# EAGLE design releborne (EAGLE 6.4)
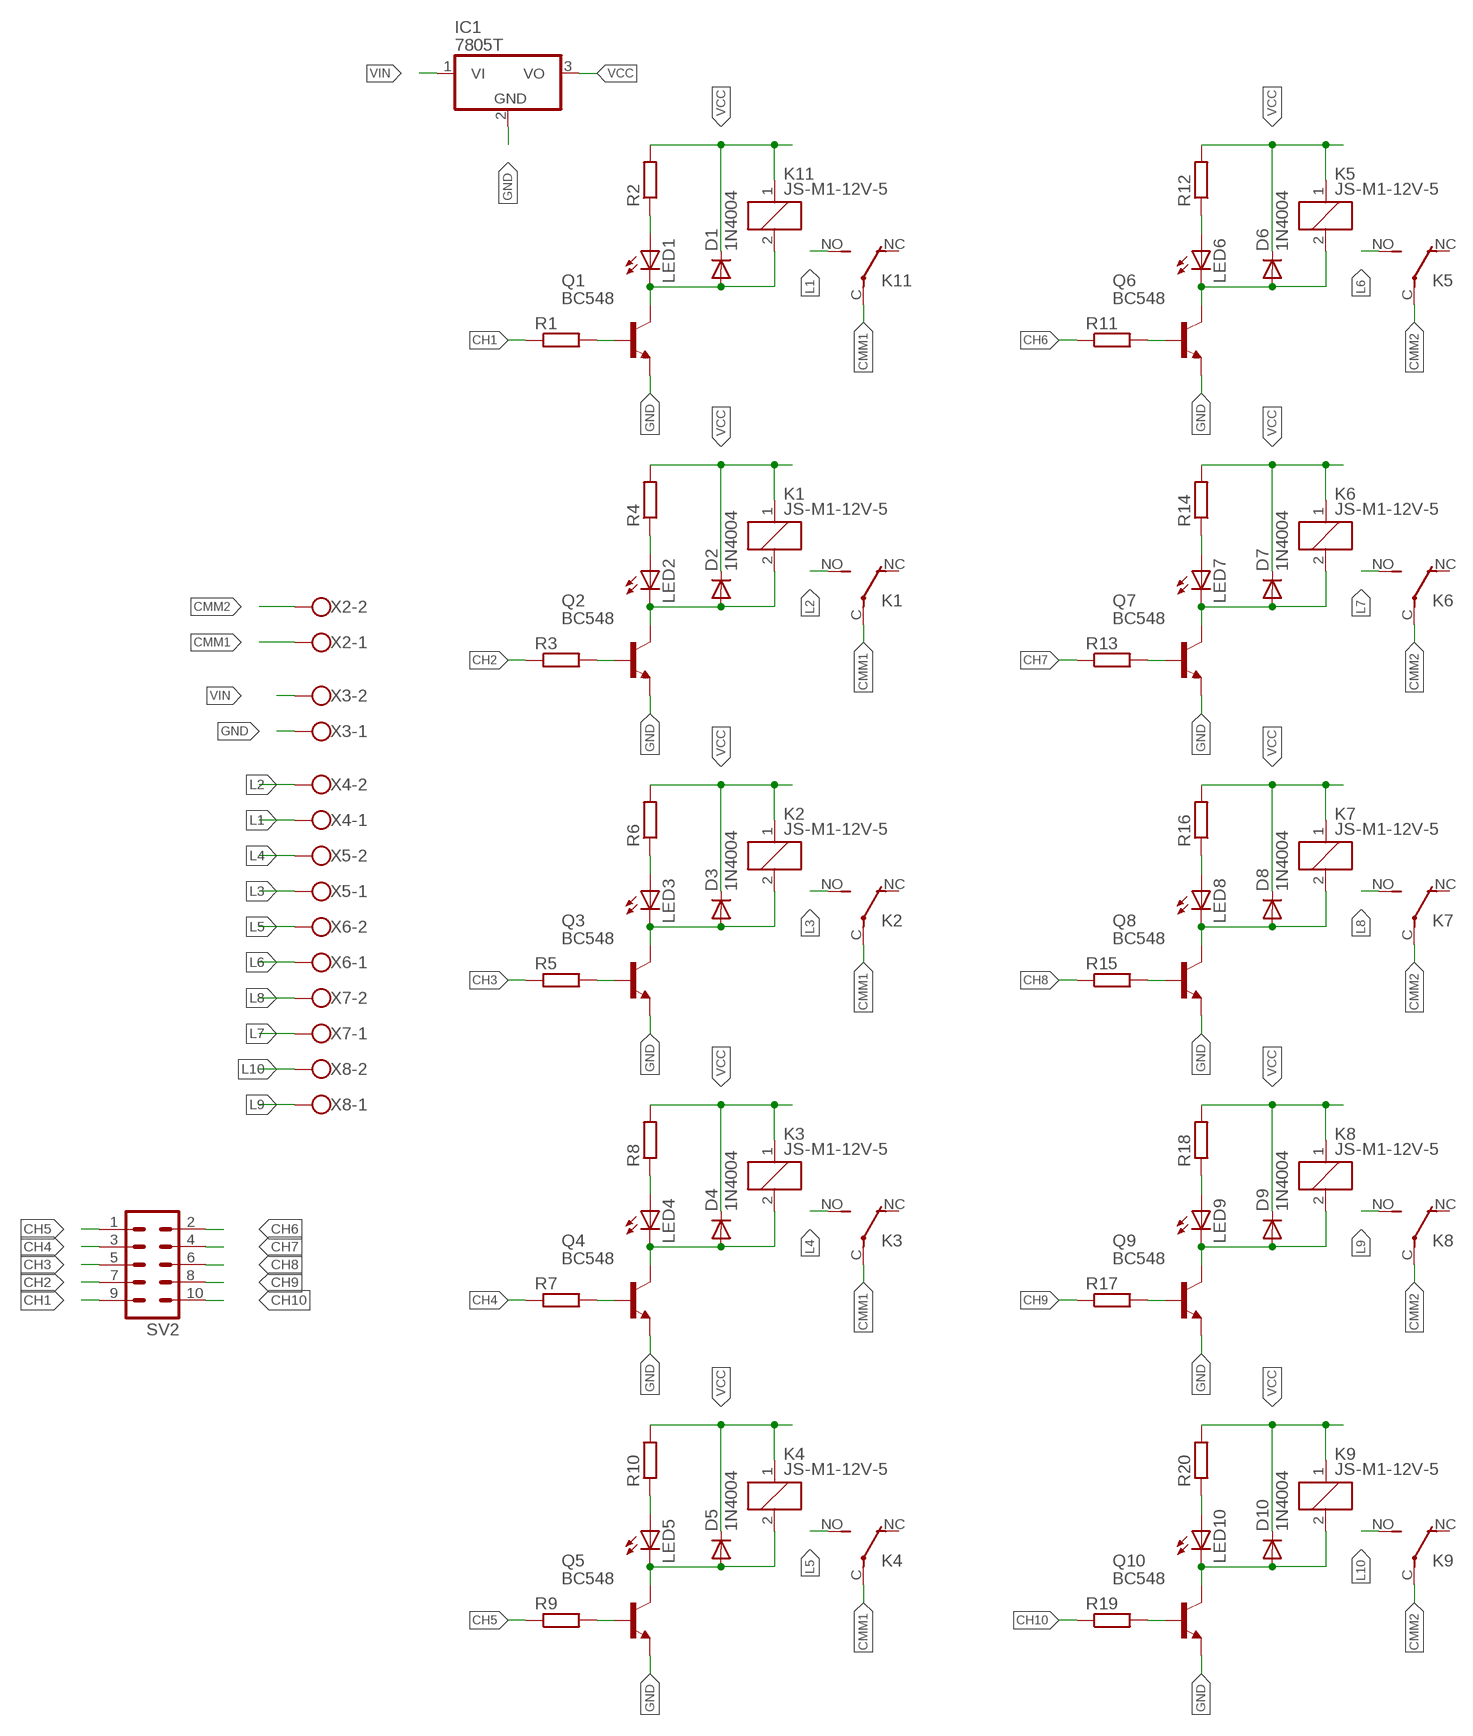
[diagram p0: schematic, sheet 1]

## Parts
D1  1N4004  [DO41-10]
D2  1N4004  [DO41-10]
D3  1N4004  [DO41-10]
D4  1N4004  [DO41-10]
D5  1N4004  [DO41-10]
D6  1N4004  [DO41-10]
D7  1N4004  [DO41-10]
D8  1N4004  [DO41-10]
D9  1N4004  [DO41-10]
D10  1N4004  [DO41-10]
IC1  7805T  [TO220H]
K1  JS-M1-12V-5  [JS-M]
K2  JS-M1-12V-5  [JS-M]
K3  JS-M1-12V-5  [JS-M]
K4  JS-M1-12V-5  [JS-M]
K5  JS-M1-12V-5  [JS-M]
K6  JS-M1-12V-5  [JS-M]
K7  JS-M1-12V-5  [JS-M]
K8  JS-M1-12V-5  [JS-M]
K9  JS-M1-12V-5  [JS-M]
K11  JS-M1-12V-5  [JS-M]
LED1  LED5MM  [LED5MM]
LED2  LED5MM  [LED5MM]
LED3  LED5MM  [LED5MM]
LED4  LED5MM  [LED5MM]
LED5  LED5MM  [LED5MM]
LED6  LED5MM  [LED5MM]
LED7  LED5MM  [LED5MM]
LED8  LED5MM  [LED5MM]
LED9  LED5MM  [LED5MM]
LED10  LED5MM  [LED5MM]
Q1  BC548  [TO92-EBC]
Q2  BC548  [TO92-EBC]
Q3  BC548  [TO92-EBC]
Q4  BC548  [TO92-EBC]
Q5  BC548  [TO92-EBC]
Q6  BC548  [TO92-EBC]
Q7  BC548  [TO92-EBC]
Q8  BC548  [TO92-EBC]
Q9  BC548  [TO92-EBC]
Q10  BC548  [TO92-EBC]
R1  R-EU_0207/10  [0207/10]
R2  R-EU_0207/10  [0207/10]
R3  R-EU_0207/10  [0207/10]
R4  R-EU_0207/10  [0207/10]
R5  R-EU_0207/10  [0207/10]
R6  R-EU_0207/10  [0207/10]
R7  R-EU_0207/10  [0207/10]
R8  R-EU_0207/10  [0207/10]
R9  R-EU_0207/10  [0207/10]
R10  R-EU_0207/10  [0207/10]
R11  R-EU_0207/10  [0207/10]
R12  R-EU_0207/10  [0207/10]
R13  R-EU_0207/10  [0207/10]
R14  R-EU_0207/10  [0207/10]
R15  R-EU_0207/10  [0207/10]
R16  R-EU_0207/10  [0207/10]
R17  R-EU_0207/10  [0207/10]
R18  R-EU_0207/10  [0207/10]
R19  R-EU_0207/10  [0207/10]
R20  R-EU_0207/10  [0207/10]
SV2  MA05-2  [MA05-2]
X2  W237-102  [W237-102]
X3  W237-102  [W237-102]
X4  W237-102  [W237-102]
X5  W237-102  [W237-102]
X6  W237-102  [W237-102]
X7  W237-102  [W237-102]
X8  W237-102  [W237-102]

## Nets
CH1: R1.1 SV2.9
CH2: R3.1 SV2.7
CH3: R5.1 SV2.5
CH4: R7.1 SV2.3
CH5: R9.1 SV2.1
CH6: R11.1 SV2.2
CH7: R13.1 SV2.4
CH8: R15.1 SV2.6
CH9: R17.1 SV2.8
CH10: R19.1 SV2.10
CMM1: K1.C(2:P) K2.C(2:P) K3.C(2:P) K4.C(2:P) K11.C(2:P) X2.1
CMM2: K5.C(2:P) K6.C(2:P) K7.C(2:P) K8.C(2:P) K9.C(2:P) X2.2
GND: IC1.2(GND) Q1.E Q2.E Q3.E Q4.E Q5.E Q6.E Q7.E Q8.E Q9.E Q10.E X3.1
L1: K11.NO(2:S) X4.1
L2: K1.NO(2:S) X4.2
L3: K2.NO(2:S) X5.1
L4: K3.NO(2:S) X5.2
L5: K4.NO(2:S) X6.2
L6: K5.NO(2:S) X6.1
L7: K6.NO(2:S) X7.1
L8: K7.NO(2:S) X7.2
L9: K8.NO(2:S) X8.1
L10: K9.NO(2:S) X8.2
N$1: Q1.B R1.2
N$2: LED1.A R2.1
N$3: Q2.B R3.2
N$4: LED2.A R4.1
N$5: D1.A K11.2 LED1.K(C) Q1.C
N$6: D2.A K1.2 LED2.K(C) Q2.C
N$7: Q3.B R5.2
N$8: LED3.A R6.1
N$9: D3.A K2.2 LED3.K(C) Q3.C
N$10: Q4.B R7.2
N$11: LED4.A R8.1
N$12: D4.A K3.2 LED4.K(C) Q4.C
N$13: Q5.B R9.2
N$14: LED5.A R10.1
N$15: D5.A K4.2 LED5.K(C) Q5.C
N$16: Q6.B R11.2
N$17: LED6.A R12.1
N$18: D6.A K5.2 LED6.K(C) Q6.C
N$19: Q7.B R13.2
N$20: LED7.A R14.1
N$21: D7.A K6.2 LED7.K(C) Q7.C
N$22: Q8.B R15.2
N$23: LED8.A R16.1
N$24: D8.A K7.2 LED8.K(C) Q8.C
N$25: Q9.B R17.2
N$26: LED9.A R18.1
N$27: D9.A K8.2 LED9.K(C) Q9.C
N$28: Q10.B R19.2
N$29: LED10.A R20.1
N$30: D10.A K9.2 LED10.K(C) Q10.C
VCC: D1.C D2.C D3.C D4.C D5.C D6.C D7.C D8.C D9.C D10.C IC1.3(VO) K1.1 K2.1 K3.1 K4.1 K5.1 K6.1 K7.1 K8.1 K9.1 K11.1 R2.2 R4.2 R6.2 R8.2 R10.2 R12.2 R14.2 R16.2 R18.2 R20.2
VIN: IC1.1(VI) X3.2
Unconnected: K1.NC(2:O) K2.NC(2:O) K3.NC(2:O) K4.NC(2:O) K5.NC(2:O) K6.NC(2:O) K7.NC(2:O) K8.NC(2:O) K9.NC(2:O) K11.NC(2:O)

## Library data of the parts
D1-D10 = diode:1N4004: DIODE general purpose rectifier, 1 A
IC1 = linear:78*: Positive VOLTAGE REGULATOR Source: http://cache.national.com/ds/LM/LM78L05.pdf http://www.fairchildsemi.com/ds/LM/LM7805.pdf
K1-K9 K11 = relay:JS-M1*: Automotive Ultra-Miniature Power Relay NAiS Source: http://www.mew-europe.com/.. en_ds_61211_0000.pdf; MF: FARNELL; MPN: JSM1-12V-5; OC_FARNELL: 910351; OC_NEWARK: 14J1764
LED1-LED10 = led:LED: LED OSRAM: - CHIPLED LG R971, LG N971, LY N971, LG Q971, LY Q971, LO R971, LY R971 LH N974, LH R974 LS Q976, LO Q976, LY Q976 LO Q996 - Hyper CHIPLED LW Q18S LB Q993, LB Q99A, LB R99A - SideLED LS A670, LO A670, LY A670, LG A670, LP A670 LB A673, LV A673, LT A673, LW A673 LH A674 LY A675 LS A676, LA A676, LO A676, LY A676, LW A676 LS A679, LY A679, LG A679 - Hyper Micro SIDELED® LS Y876, LA Y876, LO Y876, LY Y876 LT Y87S - SmartLED LW L88C, LW L88S LB L89C, LB L89S, LG L890 LS L89K, LO L89K, LY L89K LS L896, LA L896, LO L896, LY L896 - TOPLED LS T670, LO T670, LY T670, LG T670, LP T670 LSG T670, LSP T670, LSY T670, LOP T670, LYG T670 LG T671, LOG T671, LSG T671 LB T673, LV T673, LT T673, LW T673 LH T674 LS T676, LA T676, LO T676, LY T676, LB T676, LH T676, LSB T676, LW T676 LB T67C, LV T67C, LT T67C, LS T67K, LO T67K, LY T67K, LW E67C LS E67B, LA E67B, LO E67B, LY E67B, LB E67C, LV E67C, LT E67C LW T67C LS T679, LY T679, LG T679 LS T770, LO T770, LY T770, LG T770, LP T770 LB T773, LV T773, LT T773, LW T773 LH T774 LS E675, LA E675, LY E675, LS T675 LS T776, LA T776, LO T776, LY T776, LB T776 LHGB T686 LT T68C, LB T68C - Hyper Mini TOPLED® LB M676 - Mini TOPLED Santana® LG M470 LS M47K, LO M47K, LY M47K Source: http://www.osram.convergy.de LUXEON: - LUMILED® LXK2-PW12-R00, LXK2-PW12-S00, LXK2-PW14-U00, LXK2-PW14-V00 LXK2-PM12-R00, LXK2-PM12-S00, LXK2-PM14-U00 LXK2-PE12-Q00, LXK2-PE12-R00, LXK2-PE12-S00, LXK2-PE14-T00, LXK2-PE14-U00 LXK2-PB12-K00, LXK2-PB12-L00, LXK2-PB12-M00, LXK2-PB14-N00, LXK2-PB14-P00, LXK2-PB14-Q00 LXK2-PR12-L00, LXK2-PR12-M00, LXK2-PR14-Q00, LXK2-PR14-R00 LXK2-PD12-Q00, LXK2-PD12-R00, LXK2-PD12-S00 LXK2-PH12-R00, LXK2-PH12-S00 LXK2-PL12-P00, LXK2-PL12-Q00, LXK2-PL12-R00 Source: www.luxeon.com KINGBRIGHT: KA-3528ASYC Source: www.kingbright.com
Q1-Q10 = transistor-npn:BC548*: NPN Transistor
R1-R20 = rcl:R-EU_: RESISTOR, European symbol
SV2 = con-lstb:MA05-2: PIN HEADER; OC_FARNELL: unknown; OC_NEWARK: unknown
X2-X8 = con-wago-500:W237-102: WAGO SCREW CLAMP; MPN: 237-102; OC_FARNELL: unknown; OC_NEWARK: 70K9898

## Board
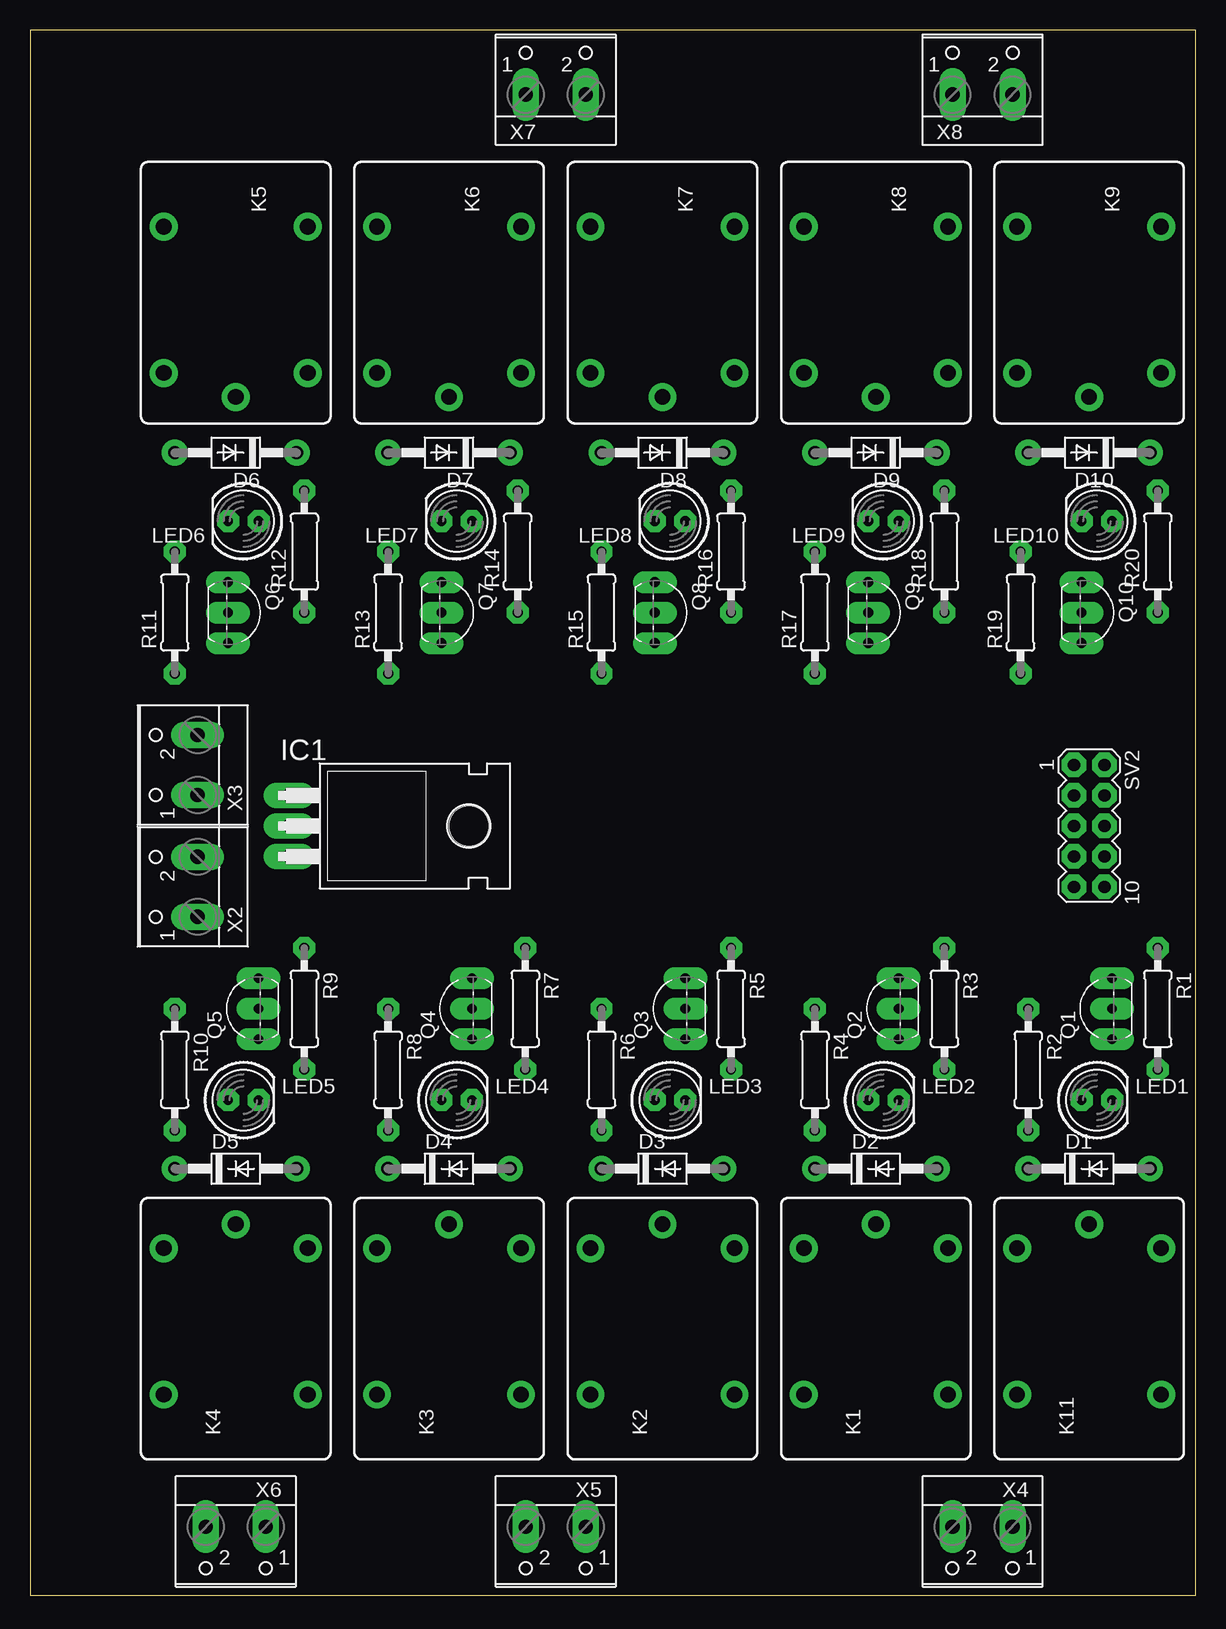
[diagram p1: board, top side]
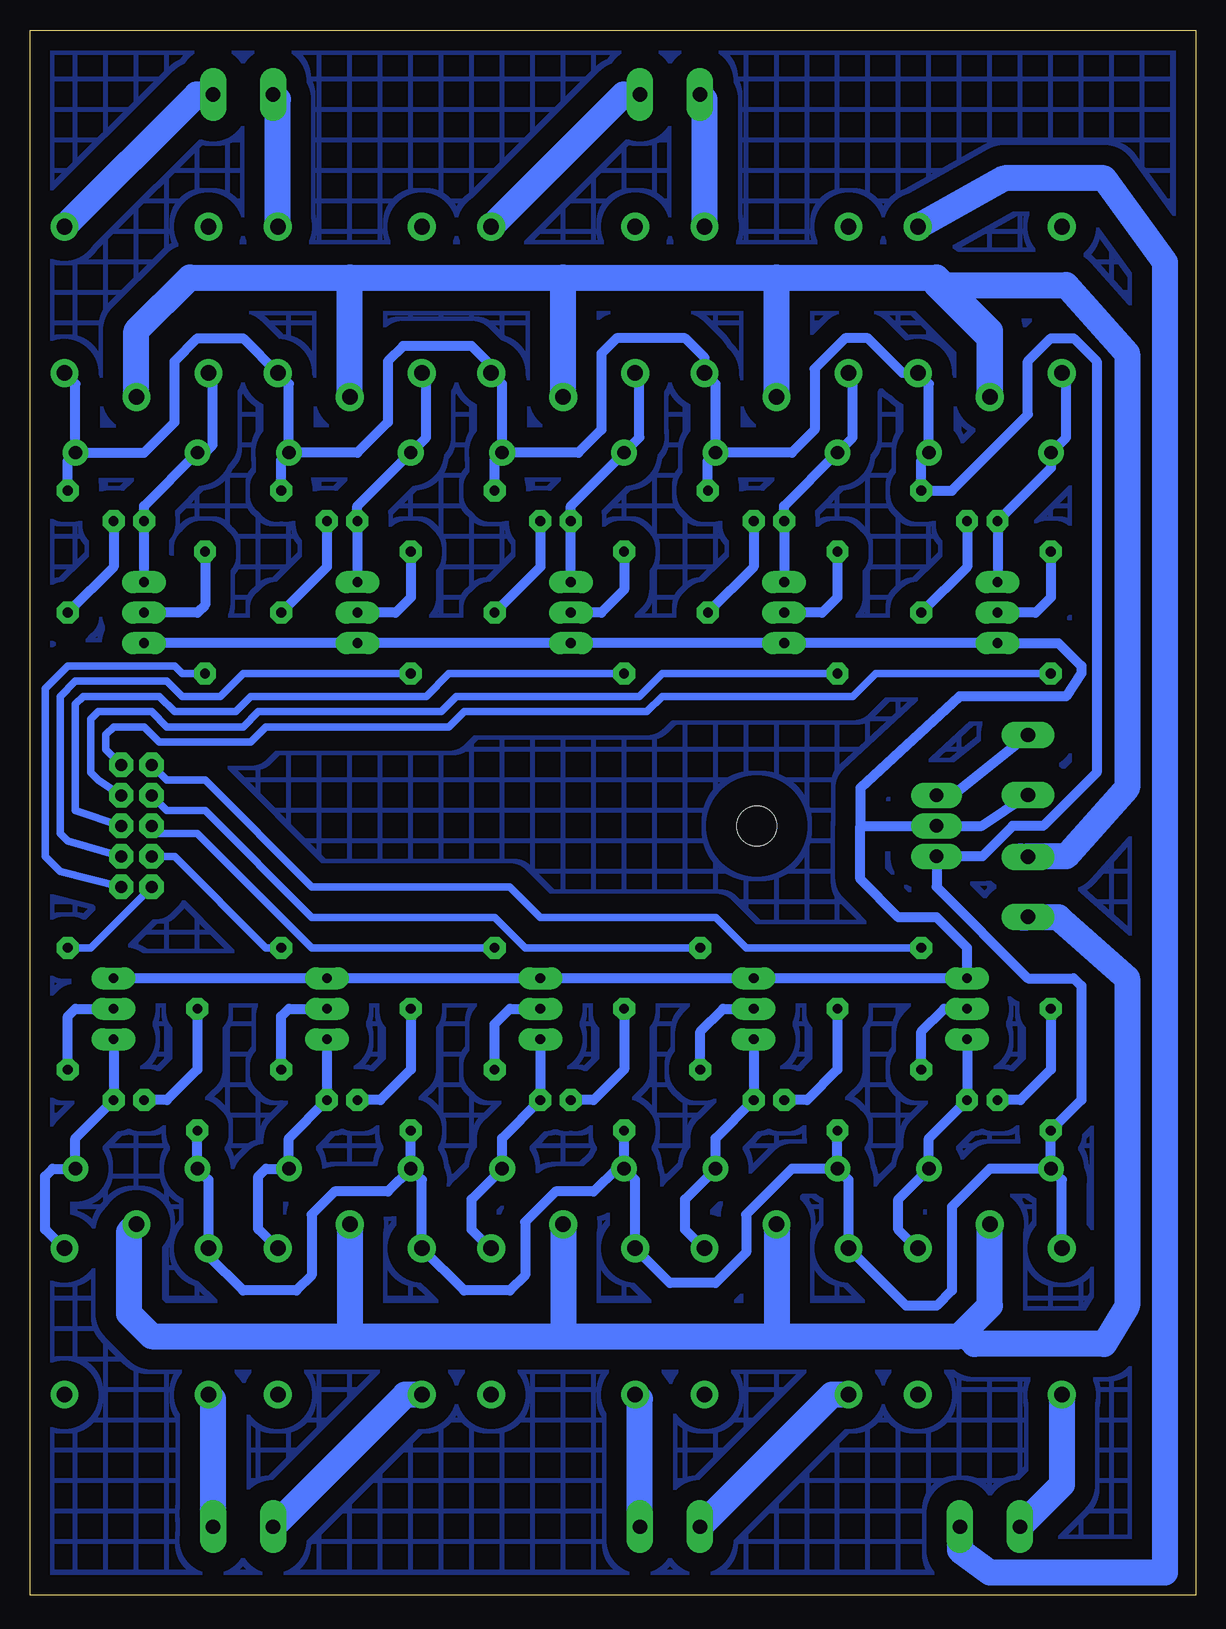
[diagram p2: board, bottom side, seen from below]

Size 97.14 x 130.48 mm. Coordinates in mm from the lower left corner, seen from the top.
Outline: 0,0 97.14,0 97.14,130.48 0,130.48 0,0
Copper layers (1*16): Top 0.035mm / dielectric 1.5mm / Bottom 0.035mm
Design rules "default *": minimum track width 24mil, minimum drill 24mil, track to track 15mil, track to pad 15mil, pad to pad 15mil, via to via 15mil, smd to smd 10mil, copper to edge 40mil, drill to drill 8mil, minimum pad ring 20mil, minimum via ring 15mil, stop-mask expansion 4mil, vias tented up to drill 0mil, thermal gap 10mil

### Footprints (pad centres in the part's own frame; a part is rotated, then mirrored left to right if it is on the bottom)
DO41-10 = drill 1.118: A 5.08,0; C -5.08,0
TO220H = drill 1.118 long: 1 -2.54,-10.16; 2 0,-10.16; 3 2.54,-10.16 | hole 3.302: 0,4.826
JS-M = drill 1.3: 1 6.7,6; 2 6.7,-6; C 8.7,0; NC -5.5,-6; NO -5.5,6
LED5MM = drill 0.813 octagon: A -1.27,0; K 1.27,0
TO92-EBC = drill 0.813 long: B 0,-1.27; C -2.54,-1.27; E 2.54,-1.27
0207/10 = drill 0.813 octagon: 1 -5.08,0; 2 5.08,0
MA05-2 = drill 1.016 octagon: 1 -5.08,-1.27; 2 -5.08,1.27; 3 -2.54,-1.27; 4 -2.54,1.27; 5 0,-1.27; 6 0,1.27; 7 2.54,-1.27; 8 2.54,1.27; 9 5.08,-1.27; 10 5.08,1.27
W237-102 = drill 1.194 long: 1 -2.5,-1.27; 2 2.5,-1.27

### Placement (x,y rotation side)
D1  88.27,35.56 0 top
D2  70.48,35.56 0 top
D3  52.7,35.56 0 top
D4  34.93,35.56 0 top
D5  17.14,35.56 0 top
D6  17.14,95.25 180 top
D7  34.93,95.25 180 top
D8  52.7,95.25 180 top
D9  70.48,95.25 180 top
D10  88.27,95.25 180 top
IC1  31.75,64.13 270 top
K1  70.48,22.22 90 top
K2  52.7,22.22 90 top
K3  34.93,22.22 90 top
K4  17.14,22.22 90 top
K5  17.14,108.59 270 top
K6  34.93,108.59 270 top
K7  52.7,108.59 270 top
K8  70.48,108.59 270 top
K9  88.27,108.59 270 top
K11  88.27,22.22 90 top
LED1  88.9,41.27 0 top
LED2  71.12,41.27 0 top
LED3  53.34,41.27 0 top
LED4  35.56,41.27 0 top
LED5  17.78,41.27 0 top
LED6  17.78,89.53 180 top
LED7  35.56,89.53 180 top
LED8  53.34,89.53 180 top
LED9  71.12,89.53 180 top
LED10  88.9,89.53 180 top
Q1  88.9,48.89 90 top
Q2  71.12,48.89 90 top
Q3  53.34,48.89 90 top
Q4  35.56,48.89 90 top
Q5  17.78,48.89 90 top
Q6  17.78,81.91 270 top
Q7  35.56,81.91 270 top
Q8  53.34,81.91 270 top
Q9  71.12,81.91 270 top
Q10  88.9,81.91 270 top
R1  93.98,48.89 270 top
R2  83.19,43.81 270 top
R3  76.2,48.89 270 top
R4  65.41,43.81 270 top
R5  58.42,48.89 270 top
R6  47.62,43.81 270 top
R7  41.27,48.89 270 top
R8  29.85,43.81 270 top
R9  22.86,48.89 270 top
R10  12.06,43.81 270 top
R11  12.06,81.91 90 top
R12  22.86,87 90 top
R13  29.85,81.91 90 top
R14  40.64,87 90 top
R15  47.62,81.91 90 top
R16  58.42,87 90 top
R17  65.41,81.91 90 top
R18  76.2,87 90 top
R19  82.55,81.91 90 top
R20  93.98,87 90 top
SV2  88.27,64.13 270 top
X2  12.7,59.05 90 top
X3  12.7,69.22 90 top
X4  79.38,4.44 180 top
X5  43.81,4.44 180 top
X6  17.14,4.44 180 top
X7  43.81,126.37 0 top
X8  79.38,126.37 0 top

### Tracks (layer width: path | path; a pad name or v marks a point on that pad's centre or on a via)
CH1
  Bottom 0.61: R1.1 92.08,53.97 SV2.9
CH2
  Bottom 0.61: R3.1 77.47,53.97 85.09,61.59 SV2.7
CH3
  Bottom 0.61: R5.1 73.66,53.97 83.19,63.5 86.36,63.5 SV2.5
CH4
  Bottom 0.61: R7.1 55.88,53.97 58.42,56.52 73.66,56.52 82.55,65.41 85.72,65.41 SV2.3
CH5
  Bottom 0.61: R9.1 37.47,53.97 40.01,56.52 54.61,56.52 57.15,59.05 73.66,59.05 82.55,67.94 85.72,67.94 SV2.1
CH6
  Bottom 0.61: R11.1 26.67,76.84 28.58,74.93 44.45,74.93 45.72,73.66 60.96,73.66 62.23,72.39 77.47,72.39 78.74,71.12 86.36,71.12 87.63,72.39 90.17,72.39 90.81,71.75 90.81,70.48 SV2.2
CH7
  Bottom 0.61: R13.1 44.45,76.84 46.36,74.93 61.59,74.93 62.87,73.66 78.11,73.66 79.38,72.39 85.72,72.39 87,73.66 91.44,73.66 92.08,73.03 92.08,68.58 91.44,67.94 SV2.4
CH8
  Bottom 0.61: R15.1 62.23,76.84 64.13,74.93 78.74,74.93 80.01,73.66 85.09,73.66 86.36,74.93 92.71,74.93 93.34,74.29 93.34,65.41 SV2.6
CH9
  Bottom 0.61: R17.1 79.38,76.84 81.28,74.93 84.45,74.93 85.72,76.2 93.34,76.2 94.61,74.93 94.61,63.5 93.98,62.86 SV2.8
CH10
  Bottom 0.61: R19.1 84.45,76.84 85.09,77.47 93.98,77.47 95.89,75.56 95.89,61.59 94.61,60.33 SV2.10
CMM1
  Bottom 2.184: K11.C 88.9,30.29 88.9,23.49 87,21.59 70.48,21.59 | K1.C 70.48,21.59 | 70.48,21.59 52.7,21.59 | 52.7,21.59 34.93,21.59 | 34.93,21.59 19.69,21.59 19.37,21.91 | 19.37,21.91 17.14,24.13 K4.C | K3.C 34.93,21.59 | K2.C 52.7,21.59 | 19.37,21.91 18.42,20.95 7.62,20.95 5.71,24.13 5.71,51.44 11.43,56.52 14.01,56.52 | 14.6,56.52 14.01,56.52 | 14.01,56.52 X2.1
CMM2
  Bottom 2.184: K9.C 88.27,105.41 83.82,109.85 70.48,109.85 | 70.48,109.85 52.7,109.85 | 52.7,109.85 34.93,109.85 | 34.93,109.85 21.59,109.85 17.14,105.41 K5.C 17.14,104.78 21.59,109.22 10.79,109.22 5.71,103.5 5.71,67.31 10.79,61.59 14.01,61.59 | K8.C 70.48,109.85 | K7.C 52.7,109.85 | K6.C 34.93,109.85 | 14.6,61.59 14.01,61.59 | 14.01,61.59 X2.2
GND
  Bottom 0.813: Q1.E Q2.E Q3.E Q4.E Q5.E 19.05,53.97 21.59,56.52 24.77,56.52 27.94,59.69 27.94,64.13 | Q10.E Q9.E Q8.E Q7.E Q6.E 11.43,79.38 9.53,77.47 9.53,76.84 10.79,74.93 19.69,74.93 27.94,67.31 27.94,64.13 | 27.94,64.13 IC1.2 17.82,64.13 X3.1
L1
  Bottom 2.184: X4.1 81.88,16.33 K11.NO
L2
  Bottom 2.184: K1.NO 65.86,16.72 X4.2
L3
  Bottom 2.184: X5.1 46.31,16.33 K2.NO
L4
  Bottom 2.184: K3.NO 30.3,16.72 X5.2
L5
  Bottom 2.184: K4.NO 11.14,9.21 X6.2
L6
  Bottom 2.184: X6.1 19.64,3.77 17.14,1.9 2.54,1.9 2.54,111.12 7.62,118.11 15.94,118.11 K5.NO
L7
  Bottom 2.184: K6.NO 40.93,124.7 X7.1
L8
  Bottom 2.184: X7.2 47.7,125.09 K7.NO
L9
  Bottom 2.184: K8.NO 76.48,124.7 X8.1
L10
  Bottom 2.184: X8.2 83.25,125.09 K9.NO
N$1
  Bottom 0.813: R1.2 93.98,48.26 93.34,48.89 Q1.B
N$2
  Bottom 0.813: R2.1 83.19,43.81 85.72,41.27 LED1.A
N$3
  Bottom 0.813: R3.2 76.2,48.26 75.56,48.89 Q2.B
N$4
  Bottom 0.813: R4.1 65.41,43.81 67.95,41.27 LED2.A
N$5
  Bottom 0.813: K11.2 95.82,30.48 95.89,30.48 95.89,34.92 95.25,35.56 D1.A 93.34,38.1 LED1.K Q1.C
N$6
  Bottom 0.813: K1.2 78.04,30.48 78.11,30.48 78.11,34.92 77.47,35.56 D2.A 75.56,38.1 LED2.K Q2.C
N$7
  Bottom 0.813: R5.2 58.42,47.62 57.15,48.89 Q3.B
N$8
  Bottom 0.813: R6.1 47.62,43.81 50.16,41.27 LED3.A
N$9
  Bottom 0.813: Q3.C LED3.K 57.79,38.1 D3.A 60.33,33.02 60.33,30.48 58.77,28.92 K2.2
N$10
  Bottom 0.813: R7.2 41.27,46.99 39.37,48.89 Q4.B
N$11
  Bottom 0.813: R8.1 29.85,43.81 32.38,41.27 LED4.A
N$12
  Bottom 0.813: Q4.C LED4.K 40.01,38.1 D4.A 42.55,33.02 42.55,30.48 40.99,28.92 K3.2
N$13
  Bottom 0.813: R9.2 22.86,46.99 20.96,48.89 Q5.B
N$14
  Bottom 0.813: R10.1 12.06,43.81 14.6,41.27 LED5.A
N$15
  Bottom 0.813: Q5.C LED5.K 22.23,38.1 D5.A 24.77,33.02 24.77,30.48 23.21,28.92 K4.2
N$16
  Bottom 0.813: R11.2 12.06,83.19 13.33,81.91 Q6.B
N$17
  Bottom 0.813: LED6.A 19.05,85.72 R12.1
N$18
  Bottom 0.813: K5.2 10.79,101.53 10.79,96.52 D6.A 12.06,93.98 LED6.K Q6.C
N$19
  Bottom 0.813: R13.2 29.85,83.19 31.12,81.91 Q7.B
N$20
  Bottom 0.813: LED7.A 36.83,85.72 R14.1
N$21
  Bottom 0.813: Q7.C LED7.K 34.29,90.81 D7.A 28.58,96.52 28.58,101.53 K6.2
N$22
  Bottom 0.813: R15.2 47.62,83.82 49.53,81.91 Q8.B
N$23
  Bottom 0.813: LED8.A 54.61,85.72 R16.1
N$24
  Bottom 0.813: Q8.C LED8.K 52.07,90.81 D8.A 46.36,96.52 46.36,101.53 K7.2
N$25
  Bottom 0.813: R17.2 65.41,83.19 66.67,81.91 Q9.B
N$26
  Bottom 0.813: LED9.A 72.39,85.72 R18.1
N$27
  Bottom 0.813: Q9.C LED9.K 69.85,90.81 D9.A 64.13,96.52 64.13,101.53 K8.2
N$28
  Bottom 0.813: R19.2 82.55,82.55 83.19,81.91 Q10.B
N$29
  Bottom 0.813: LED10.A 90.17,85.72 R20.1
N$30
  Bottom 0.813: Q10.C LED10.K 87.63,90.81 D10.A 82.55,95.25 81.92,95.88 81.92,101.53 K9.2
N$31
  pour Bottom (isolate 1.676, hatched): 0,130.18 97.16,130.18 97.16,-0.64 0,-0.64
VCC
  Bottom 0.813: D2.C 67.31,33.66 71.75,33.66 73.66,31.75 73.66,26.67 74.93,25.4 79.38,25.4 82.27,28.29 K11.1 82.27,34.64 D1.C R2.2 | D4.C 28.93,34.64 K3.1 24.13,24.13 21.59,24.13 20.32,25.4 20.32,32.38 17.14,35.56 D5.C | K4.1 11.14,34.64 D5.C | D4.C R8.2 | D5.C R10.2 9.53,41.27 9.53,50.8 10.16,51.44 13.97,51.44 21.59,59.05 IC1.3 17.78,61.59 15.24,64.13 12.7,64.13 8.25,68.58 8.25,102.87 10.16,104.78 12.06,104.78 13.97,102.87 13.97,98.43 20.32,92.07 R12.2 22.86,94.61 D6.C 22.23,100.97 K5.1 24.42,101.88 27.3,104.78 29.21,104.78 31.75,102.23 31.75,97.16 33.66,95.25 D7.C | D3.C 46.7,34.64 K2.1 43.81,26.03 40.01,26.03 37.47,28.57 37.47,31.75 33.66,35.56 D4.C | D3.C R6.2 | D2.C 64.48,34.64 K1.1 60.96,25.4 57.15,25.4 55.88,26.67 55.88,31.11 53.34,33.66 50.16,33.66 48.26,35.56 D3.C | D2.C R4.2 | R20.2 93.98,94.61 D10.C | R18.2 76.2,94.61 D9.C | R16.2 58.42,94.61 D8.C | R14.2 40.64,94.61 D7.C | D10.C 93.34,100.97 K9.1 | D8.C 57.79,100.97 K7.1 58.7,102.52 60.33,104.14 66.04,104.14 67.31,102.87 67.31,97.79 69.85,95.25 D9.C | D10.C 87.63,95.25 85.09,97.79 85.09,102.87 83.19,104.78 79.38,104.78 K8.1 75.56,100.97 D9.C | D8.C 51.44,95.25 49.53,97.16 49.53,103.5 48.26,104.78 42.55,104.78 40.93,103.16 K6.1 40.01,100.97 D7.C
VIN
  Bottom 0.813: IC1.1 20.28,66.67 X3.2